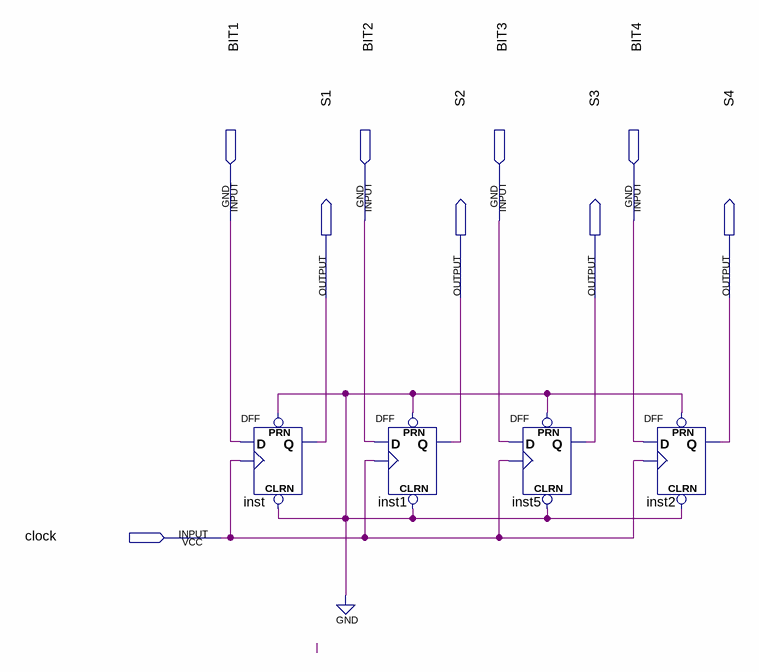
[diagram p0: schematic sheet]
// Quartus schematic registrador.bdf as structural Verilog: 4 symbols, 9 pins
module registrador (
  input  BIT1,
  input  BIT2,
  input  BIT3,
  input  BIT4,
  input  clock,
  output S1,
  output S2,
  output S3,
  output S4
);

  DFF inst (.CLRN(1'b0), .CLK(clock), .D(BIT1), .PRN(1'b0), .Q(S1));
  DFF inst1 (.CLRN(1'b0), .CLK(clock), .D(BIT2), .PRN(1'b0), .Q(S2));
  DFF inst5 (.CLRN(1'b0), .CLK(clock), .D(BIT3), .PRN(1'b0), .Q(S3));
  DFF inst2 (.CLRN(1'b0), .CLK(clock), .D(BIT4), .PRN(1'b0), .Q(S4));
endmodule
